# Altium schematic sheet uc.SchDoc: uC_LPC1769_SCH
size A3; DrawnBy: Hojnadel - Salazar Ato; Revision: Rev1.0; SheetNumber: 6; SheetTotal: 6
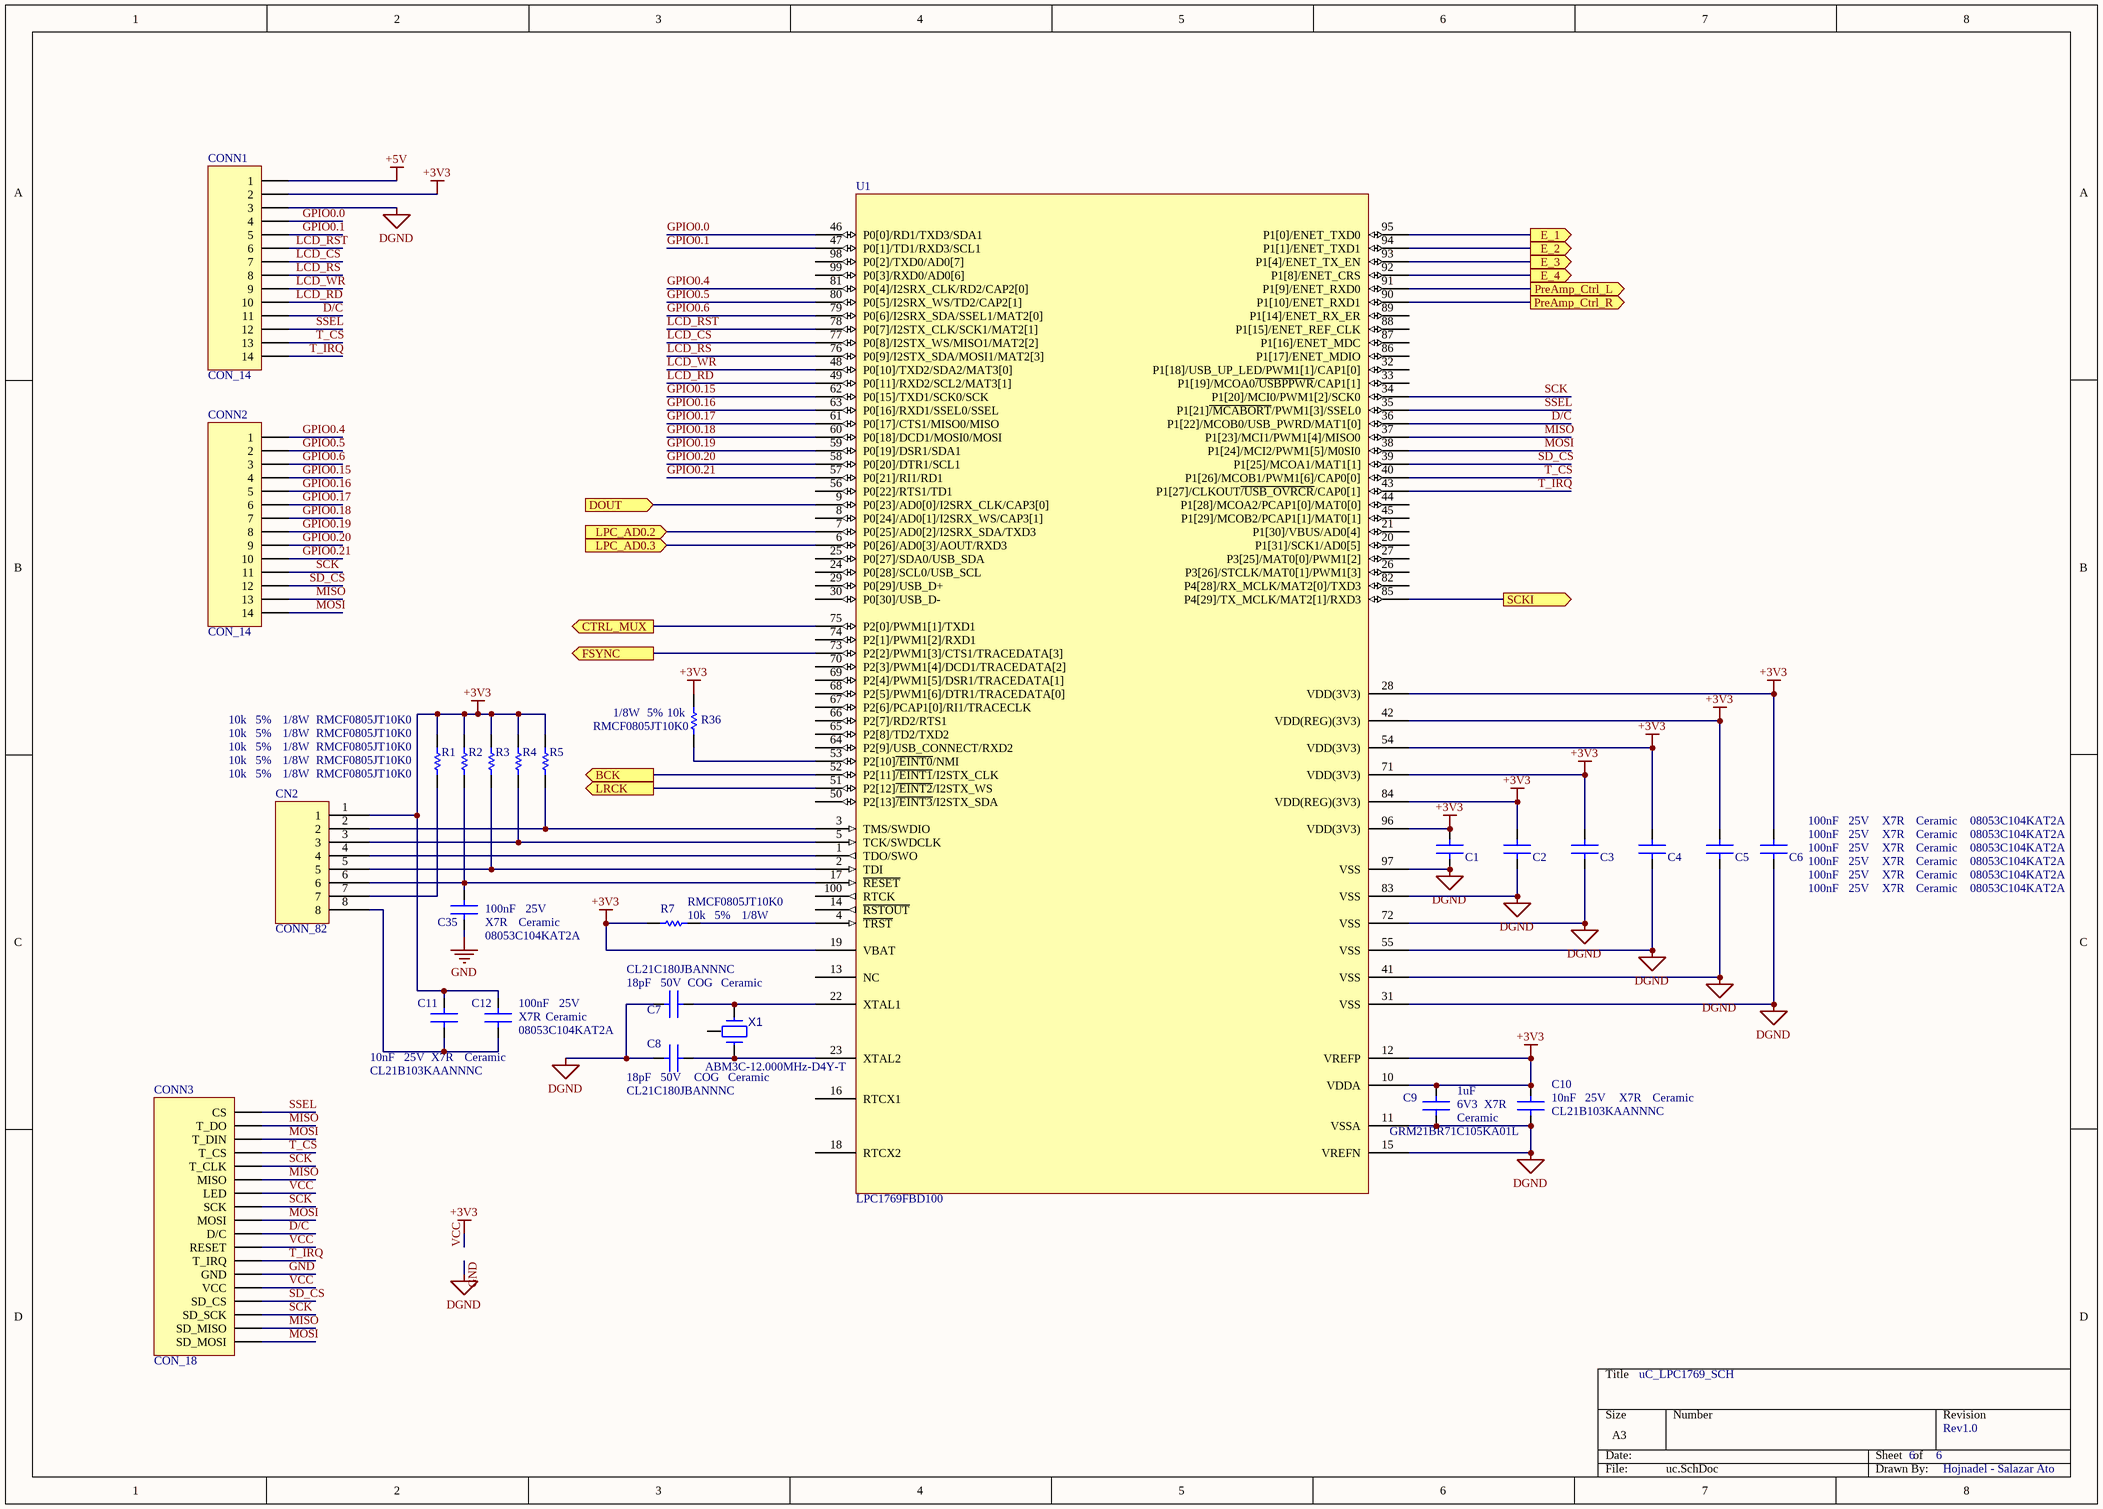
[diagram p0: uc.SchDoc]

## Parts
C1  C: 100nF  V: 25V  Part Number: 08053C104KAT2A  Temp Coef: X7R  Material: Ceramic  [C_0805]  (hidden comment: 100nF 25V X7R Ceramic)
C2  C: 100nF  V: 25V  Part Number: 08053C104KAT2A  Temp Coef: X7R  Material: Ceramic  [C_0805]  (hidden comment: 100nF 25V X7R Ceramic)
C3  C: 100nF  V: 25V  Part Number: 08053C104KAT2A  Temp Coef: X7R  Material: Ceramic  [C_0805]  (hidden comment: 100nF 25V X7R Ceramic)
C4  C: 100nF  V: 25V  Part Number: 08053C104KAT2A  Temp Coef: X7R  Material: Ceramic  [C_0805]  (hidden comment: 100nF 25V X7R Ceramic)
C5  C: 100nF  V: 25V  Part Number: 08053C104KAT2A  Temp Coef: X7R  Material: Ceramic  [C_0805]  (hidden comment: 100nF 25V X7R Ceramic)
C6  C: 100nF  V: 25V  Part Number: 08053C104KAT2A  Temp Coef: X7R  Material: Ceramic  [C_0805]  (hidden comment: 100nF 25V X7R Ceramic)
C7  C: 18pF  V: 50V  Part Number: CL21C180JBANNNC  Temp Coef: COG  Material: Ceramic  [C_0805]  (hidden comment: 18pF 50V COG Ceramic)
C8  C: 18pF  V: 50V  Part Number: CL21C180JBANNNC  Temp Coef: COG  Material: Ceramic  [C_0805]  (hidden comment: 18pF 50V COG Ceramic)
C9  C: 1uF  V: 6V3  Part Number: GRM21BR71C105KA01L  Temp Coef: X7R  Material: Ceramic  [C_0805]  (hidden comment: 1uF 6V3 X7R Ceramic)
C10  C: 10nF  V: 25V  Part Number: CL21B103KAANNNC  Temp Coef: X7R  Material: Ceramic  [C_0805]  (hidden comment: 10nF 25V X7R Ceramic)
C11  C: 10nF  V: 25V  Part Number: CL21B103KAANNNC  Temp Coef: X7R  Material: Ceramic  [C_0805]  (hidden comment: 10nF 25V X7R Ceramic)
C12  C: 100nF  V: 25V  Part Number: 08053C104KAT2A  Temp Coef: X7R  Material: Ceramic  [C_0805]  (hidden comment: 100nF 25V X7R Ceramic)
C35  C: 100nF  V: 25V  Temp Coef: X7R  Part Number: 08053C104KAT2A  Material: Ceramic  [C_0805]  (hidden comment: 100nF 25V X7R Ceramic)
CN2  CONN_82  [HDR_M_08P_0.1]
CONN1  CON_14  [1x14x2.54 Pin Header TH V]
CONN2  CON_14  [1x14x2.54 Pin Header TH V]
CONN3  CON_18  [2x9x2.54 Pin Header TH V]
R1  value 10k  Power: 1/8W  Part Number: RMCF0805JT10K0  Tolerance: 5%  [R_0805]  (hidden comment: 10k 5% 1/8W)
R2  value 10k  Part Number: RMCF0805JT10K0  Tolerance: 5%  Power: 1/8W  [R_0805]  (hidden comment: 10k 5% 1/8W)
R3  value 10k  Power: 1/8W  Part Number: RMCF0805JT10K0  Tolerance: 5%  [R_0805]  (hidden comment: 10k 5% 1/8W)
R4  value 10k  Power: 1/8W  Part Number: RMCF0805JT10K0  Tolerance: 5%  [R_0805]  (hidden comment: 10k 5% 1/8W)
R5  value 10k  Power: 1/8W  Part Number: RMCF0805JT10K0  Tolerance: 5%  [R_0805]  (hidden comment: 10k 5% 1/8W)
R7  value 10k  Power: 1/8W  Part Number: RMCF0805JT10K0  Tolerance: 5%  [R_0805]  (hidden comment: 10k 5% 1/8W)
R36  value 10k  Power: 1/8W  Part Number: RMCF0805JT10K0  Tolerance: 5%  [R_0805]  (hidden comment: 10k 5% 1/8W)
U1  LPC1769FBD100  [LQFP100]
X1  Part Number: ABM3C-12.000MHz-D4Y-T  [ABMC_XTAL]  (hidden comment: XTAL_HF)

## Ports
BCK (out), CTRL_MUX (out), DOUT (in), E_1 (out), E_2 (out), E_3 (out), E_4 (out), FSYNC (out), LPC_AD0.2 (in), LPC_AD0.3 (in), LRCK (out), PreAmp_Ctrl_L (out), PreAmp_Ctrl_R (out), SCKI (out)

## Nets
+5V: CONN1.1
GND: C1.2 C2.2 C3.2 C4.2 C5.2 C6.2 C7.1 C8.1 C9.2 C10.2 C35.2 CONN1.3 CONN3.13(GND) U1.11(VSSA) U1.15(VREFN) U1.31(VSS) U1.41(VSS) U1.55(VSS) U1.72(VSS) U1.83(VSS) U1.97(VSS)  [also labelled DGND]
VCC: C1.1 C2.1 C3.1 C4.1 C5.1 C6.1 C9.1 C10.1 C11.1 C12.1 CN2.1 CONN1.2 CONN3.7(LED) CONN3.11(RESET) CONN3.14(VCC) R1.2 R2.2 R3.2 R4.2 R5.2 R7.2 R36.2 U1.10(VDDA) U1.12(VREFP) U1.19(VBAT) U1.28(VDD(3V3)) U1.42(VDD(REG)(3V3)) U1.54(VDD(3V3)) U1.71(VDD(3V3)) U1.84(VDD(REG)(3V3)) U1.96(VDD(3V3))  [also labelled +3V3]
BCK: U1.52(P2[11]~{/EINT1}/I2STX_CLK) ; port BCK
CTRL_MUX: U1.75(P2[0]/PWM1[1]/TXD1) ; port CTRL_MUX
D/C: CONN1.11 CONN3.10(D/C) U1.36(P1[22]/MCOB0/USB_PWRD/MAT1[0])
DOUT: U1.9(P0[23]/AD0[0]/I2SRX_CLK/CAP3[0]) ; port DOUT
E_1: U1.95(P1[0]/ENET_TXD0) ; port E_1
E_2: U1.94(P1[1]/ENET_TXD1) ; port E_2
E_3: U1.93(P1[4]/ENET_TX_EN) ; port E_3
E_4: U1.92(P1[8]/ENET_CRS) ; port E_4
FSYNC: U1.73(P2[2]/PWM1[3]/CTS1/TRACEDATA[3]) ; port FSYNC
GPIO0.0: CONN1.4 U1.46(P0[0]/RD1/TXD3/SDA1)
GPIO0.1: CONN1.5 U1.47(P0[1]/TD1/RXD3/SCL1)
GPIO0.4: CONN2.1 U1.81(P0[4]/I2SRX_CLK/RD2/CAP2[0])
GPIO0.5: CONN2.2 U1.80(P0[5]/I2SRX_WS/TD2/CAP2[1])
GPIO0.6: CONN2.3 U1.79(P0[6]/I2SRX_SDA/SSEL1/MAT2[0])
GPIO0.15: CONN2.4 U1.62(P0[15]/TXD1/SCK0/SCK)
GPIO0.16: CONN2.5 U1.63(P0[16]/RXD1/SSEL0/SSEL)
GPIO0.17: CONN2.6 U1.61(P0[17]/CTS1/MISO0/MISO)
GPIO0.18: CONN2.7 U1.60(P0[18]/DCD1/MOSI0/MOSI)
GPIO0.19: CONN2.8 U1.59(P0[19]/DSR1/SDA1)
GPIO0.20: CONN2.9 U1.58(P0[20]/DTR1/SCL1)
GPIO0.21: CONN2.10 U1.57(P0[21]/RI1/RD1)
LCD_CS: CONN1.7 U1.77(P0[8]/I2STX_WS/MISO1/MAT2[2])
LCD_RD: CONN1.10 U1.49(P0[11]/RXD2/SCL2/MAT3[1])
LCD_RS: CONN1.8 U1.76(P0[9]/I2STX_SDA/MOSI1/MAT2[3])
LCD_RST: CONN1.6 U1.78(P0[7]/I2STX_CLK/SCK1/MAT2[1])
LCD_WR: CONN1.9 U1.48(P0[10]/TXD2/SDA2/MAT3[0])
LPC_AD0.2: U1.7(P0[25]/AD0[2]/I2SRX_SDA/TXD3) ; port LPC_AD0.2
LPC_AD0.3: U1.6(P0[26]/AD0[3]/AOUT/RXD3) ; port LPC_AD0.3
LRCK: U1.51(P2[12]~{/EINT2}/I2STX_WS) ; port LRCK
MISO: CONN2.13 CONN3.2(T_DO) CONN3.6(MISO) CONN3.17(SD_MISO) U1.37(P1[23]/MCI1/PWM1[4]/MISO0)
MOSI: CONN2.14 CONN3.3(T_DIN) CONN3.9(MOSI) CONN3.18(SD_MOSI) U1.38(P1[24]/MCI2/PWM1[5]/M0SI0)
PreAmp_Ctrl_L: U1.91(P1[9]/ENET_RXD0) ; port PreAmp_Ctrl_L
PreAmp_Ctrl_R: U1.90(P1[10]/ENET_RXD1) ; port PreAmp_Ctrl_R
SCK: CONN2.11 CONN3.5(T_CLK) CONN3.8(SCK) CONN3.16(SD_SCK) U1.34(P1[20]/MCI0/PWM1[2]/SCK0)
SCKI: U1.85(P4[29]/TX_MCLK/MAT2[1]/RXD3) ; port SCKI
SD_CS: CONN2.12 CONN3.15(SD_CS) U1.39(P1[25]/MCOA1/MAT1[1])
SSEL: CONN1.12 CONN3.1(CS) U1.35(P1[21]~{/MCABORT}/PWM1[3]/SSEL0)
T_CS: CONN1.13 CONN3.4(T_CS) U1.40(P1[26]/MCOB1/PWM1[6]/CAP0[0])
T_IRQ: CONN1.14 CONN3.12(T_IRQ) U1.43(P1[27]/CLKOUT~{/USB_OVRCR}/CAP0[1])
NetC7_2: C7.2 U1.22(XTAL1) X1.1
NetC8_2: C8.2 U1.23(XTAL2) X1.3
NetC11_2: C11.2 C12.2 CN2.8
NetC35_1: C35.1 CN2.6 R2.1 U1.17(~{RESET})
NetCN2_2: CN2.2 R5.1 U1.3(TMS/SWDIO)
NetCN2_3: CN2.3 R4.1 U1.5(TCK/SWDCLK)
NetCN2_4: CN2.4 U1.1(TDO/SWO)
NetCN2_5: CN2.5 R3.1 U1.2(TDI)
NetCN2_7: CN2.7 R1.1
NetR7_1: R7.1 U1.4(~{TRST})
NetR36_1: R36.1 U1.53(P2[10]~{/EINT0}/NMI)
NetX1_2: X1.2(GND) X1.4

Not connected (* = marked no-connect by the designer): U1 8(P0[24]/AD0[1]/I2SRX_WS/CAP3[1]) 13(NC) 14(~{RSTOUT}) 16(RTCX1) 18(RTCX2) 20(P1[31]/SCK1/AD0[5]) 21(P1[30]/VBUS/AD0[4]) 24(P0[28]/SCL0/USB_SCL) 25(P0[27]/SDA0/USB_SDA) 26(P3[26]/STCLK/MAT0[1]/PWM1[3]) 27(P3[25]/MAT0[0]/PWM1[2]) 29(P0[29]/USB_D+) 30(P0[30]/USB_D-) 32(P1[18]/USB_UP_LED/PWM1[1]/CAP1[0]) 33(P1[19]/MCOA0~{/USBPPWR}/CAP1[1]) 44(P1[28]/MCOA2/PCAP1[0]/MAT0[0]) 45(P1[29]/MCOB2/PCAP1[1]/MAT0[1]) 50(P2[13]~{/EINT3}/I2STX_SDA) 56(P0[22]/RTS1/TD1) 64(P2[9]/USB_CONNECT/RXD2) 65(P2[8]/TD2/TXD2) 66(P2[7]/RD2/RTS1) 67(P2[6]/PCAP1[0]/RI1/TRACECLK) 68(P2[5]/PWM1[6]/DTR1/TRACEDATA[0]) 69(P2[4]/PWM1[5]/DSR1/TRACEDATA[1]) 70(P2[3]/PWM1[4]/DCD1/TRACEDATA[2]) 74(P2[1]/PWM1[2]/RXD1) 82(P4[28]/RX_MCLK/MAT2[0]/TXD3) 86(P1[17]/ENET_MDIO) 87(P1[16]/ENET_MDC) 88(P1[15]/ENET_REF_CLK) 89(P1[14]/ENET_RX_ER) 98(P0[2]/TXD0/AD0[7]) 99(P0[3]/RXD0/AD0[6]) 100(RTCK)

## Library data of the parts
C1-C12 C35 = Cap1: Capacitor
CONN1 CONN2 = CON_14: CONN TFT 3.5
CONN3 = CON_18: CON_TFT_2.8
R1-R5 R7 R36 = Res1: Resistor
U1 = LPC1768FBD100: CPU Cortex M3; Part Number: LPC1769FBD100
X1 = XTAL_HF: Crystal